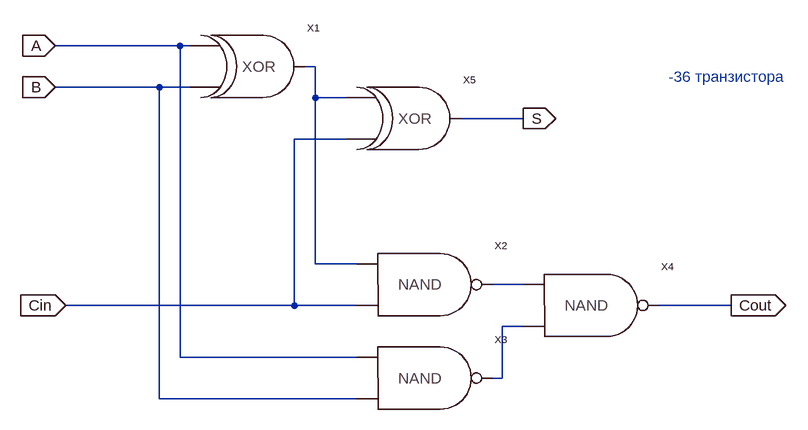
[diagram p0: schematic naive_fa_36.asc]
naive_fa_36.asc, the LTspice schematic file:
Version 4
SHEET 1 1392 680
WIRE 432 -48 240 -48
WIRE 448 -48 432 -48
WIRE 640 -16 624 -16
WIRE 400 16 240 16
WIRE 448 16 400 16
WIRE 640 32 640 -16
WIRE 688 32 640 32
WIRE 960 64 864 64
WIRE 688 96 608 96
WIRE 640 288 640 32
WIRE 704 288 640 288
WIRE 960 320 912 320
WIRE 608 352 608 96
WIRE 608 352 256 352
WIRE 704 352 608 352
WIRE 1280 352 1168 352
WIRE 960 384 928 384
WIRE 432 432 432 -48
WIRE 704 432 432 432
WIRE 928 464 928 384
WIRE 928 464 912 464
WIRE 400 496 400 16
WIRE 704 496 400 496
FLAG 240 -48 A
IOPIN 240 -48 In
FLAG 240 16 B
IOPIN 240 16 In
FLAG 256 352 Cin
IOPIN 256 352 In
FLAG 960 64 S
IOPIN 960 64 Out
FLAG 1280 352 Cout
IOPIN 1280 352 Out
SYMBOL XOR_2 480 -16 R0
SYMATTR InstName X1
SYMBOL XOR_2 720 64 R0
SYMATTR InstName X5
SYMBOL NAND_2 736 320 R0
SYMATTR InstName X2
SYMBOL NAND_2 736 464 R0
SYMATTR InstName X3
SYMBOL NAND_2 992 352 R0
SYMATTR InstName X4
TEXT 1184 0 Left 2 ;-36 транзистора

The netlist it stands for:
* naive_fa_36.asc
XX1 A B N001 XOR_2  ; pins Vin1 Vin2 Vout
XX5 N001 Cin S XOR_2  ; pins Vin1 Vin2 Vout
XX2 N001 Cin N002 NAND_2  ; pins Vin1 Vin2 Vout
XX3 A B N003 NAND_2  ; pins Vin1 Vin2 Vout
XX4 N002 N003 Cout NAND_2  ; pins Vin1 Vin2 Vout
* -36 транзистора
.backanno
.end